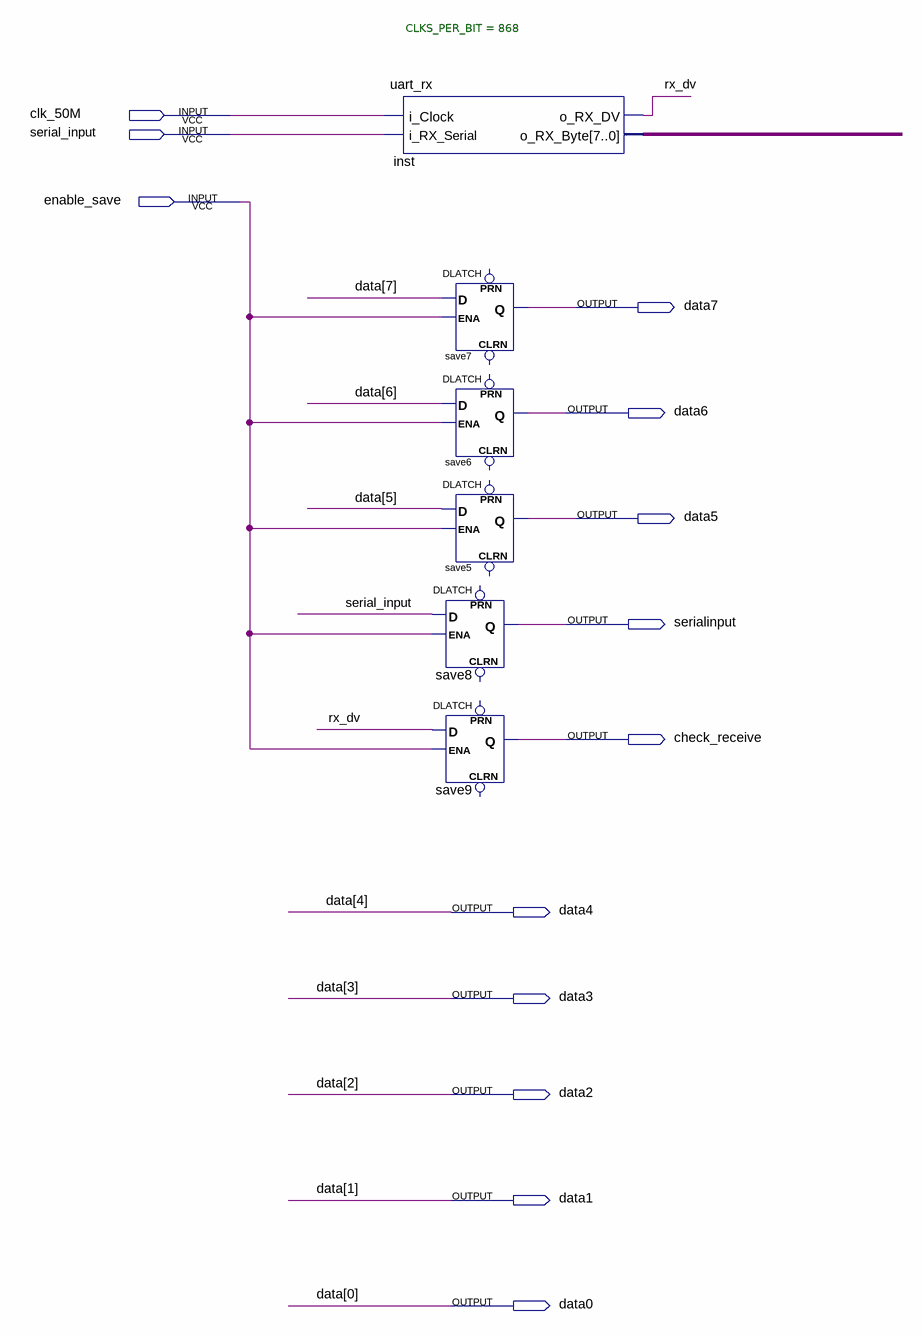
[diagram p0: schematic sheet]
// Quartus schematic uart_receiver_top.bdf as structural Verilog: 6 symbols, 13 pins
module uart_receiver_top (
  input  clk_50M,
  input  serial_input,
  input  enable_save,
  output data7,
  output data6,
  output data5,
  output serialinput,
  output check_receive,
  output data4,
  output data3,
  output data2,
  output data1,
  output data0
);

  wire rx_dv;
  wire [7:0] inst_o_rx_byte;

  uart_rx #(.CLKS_PER_BIT(868)) inst (
    .i_Clock(clk_50M), .i_RX_Serial(serial_input), .o_RX_DV(rx_dv), .o_RX_Byte(inst_o_rx_byte));
  DLATCH save7 (.D(data7), .ENA(enable_save), .Q(data7));  // open: CLRN, PRN
  DLATCH save6 (.D(data6), .ENA(enable_save), .Q(data6));  // open: CLRN, PRN
  DLATCH save5 (.D(data5), .ENA(enable_save), .Q(data5));  // open: CLRN, PRN
  DLATCH save8 (.D(serial_input), .ENA(enable_save), .Q(serialinput));  // open: CLRN, PRN
  DLATCH save9 (.D(rx_dv), .ENA(enable_save), .Q(check_receive));  // open: CLRN, PRN
endmodule
